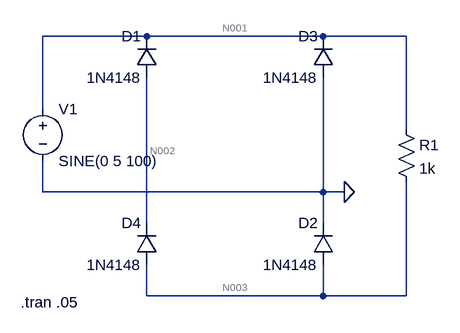
[diagram p0: schematic 1_4_1.asc]
1_4_1.asc, the LTspice schematic file:
Version 4
SHEET 1 880 680
WIRE 176 16 16 16
WIRE 448 16 176 16
WIRE 576 16 448 16
WIRE 16 128 16 16
WIRE 576 160 576 16
WIRE 16 256 16 208
WIRE 448 256 448 80
WIRE 448 256 16 256
WIRE 480 256 448 256
WIRE 176 304 176 80
WIRE 448 304 448 256
WIRE 176 416 176 368
WIRE 448 416 448 368
WIRE 448 416 176 416
WIRE 576 416 576 240
WIRE 576 416 448 416
FLAG 480 256 0
SYMBOL voltage 16 112 R0
WINDOW 123 0 0 Left 0
WINDOW 39 0 0 Left 0
SYMATTR InstName V1
SYMATTR Value SINE(0 5 100)
SYMBOL diode 192 80 R180
WINDOW 0 24 64 Left 2
WINDOW 3 24 0 Left 2
SYMATTR InstName D1
SYMATTR Value 1N4148
SYMBOL diode 464 80 R180
WINDOW 0 24 64 Left 2
WINDOW 3 24 0 Left 2
SYMATTR InstName D3
SYMATTR Value 1N4148
SYMBOL diode 192 368 R180
WINDOW 0 24 64 Left 2
WINDOW 3 24 0 Left 2
SYMATTR InstName D4
SYMATTR Value 1N4148
SYMBOL diode 464 368 R180
WINDOW 0 24 64 Left 2
WINDOW 3 24 0 Left 2
SYMATTR InstName D2
SYMATTR Value 1N4148
SYMBOL res 560 144 R0
SYMATTR InstName R1
SYMATTR Value 1k
TEXT -18 426 Left 2 !.tran .05

The netlist it stands for:
* 1_4_1.asc
V1 N001 0 SINE(0 5 100)
D1 N002 N001 1N4148
D3 0 N001 1N4148
D4 N003 N002 1N4148
D2 N003 0 1N4148
R1 N001 N003 1k
.model D D
.lib standard.dio
.tran .05
.backanno
.end

* Results of the author's LTspice run, read from the files saved beside the schematic
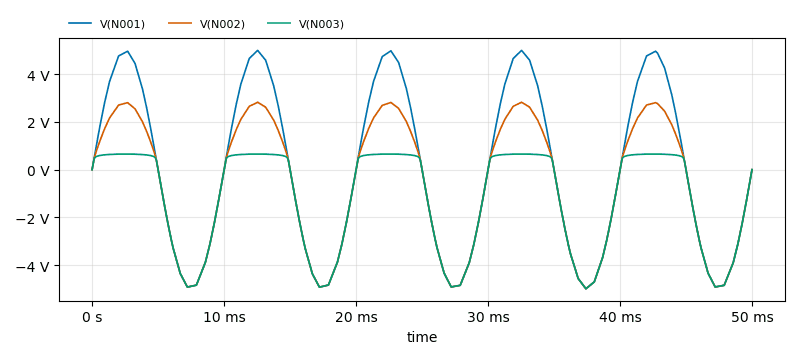
[diagram p1: Transient Analysis of 1_4_1.asc, plotted from the saved traces]
* Transient Analysis, 1 run:
*   V(N001): min -4.993 V, max 4.998 V, average -672.9 µV, rms 3.508 V, last 0 V
*   V(N002): min -4.992 V, max 2.825 V, average -639.3 mV, rms 2.869 V, last -7.63 µV
*   V(N003): min -4.992 V, max 653.2 mV, average -1.278 V, rms 2.516 V, last -15.26 µV